# Altium project ChaoticCircuits.PrjPcb
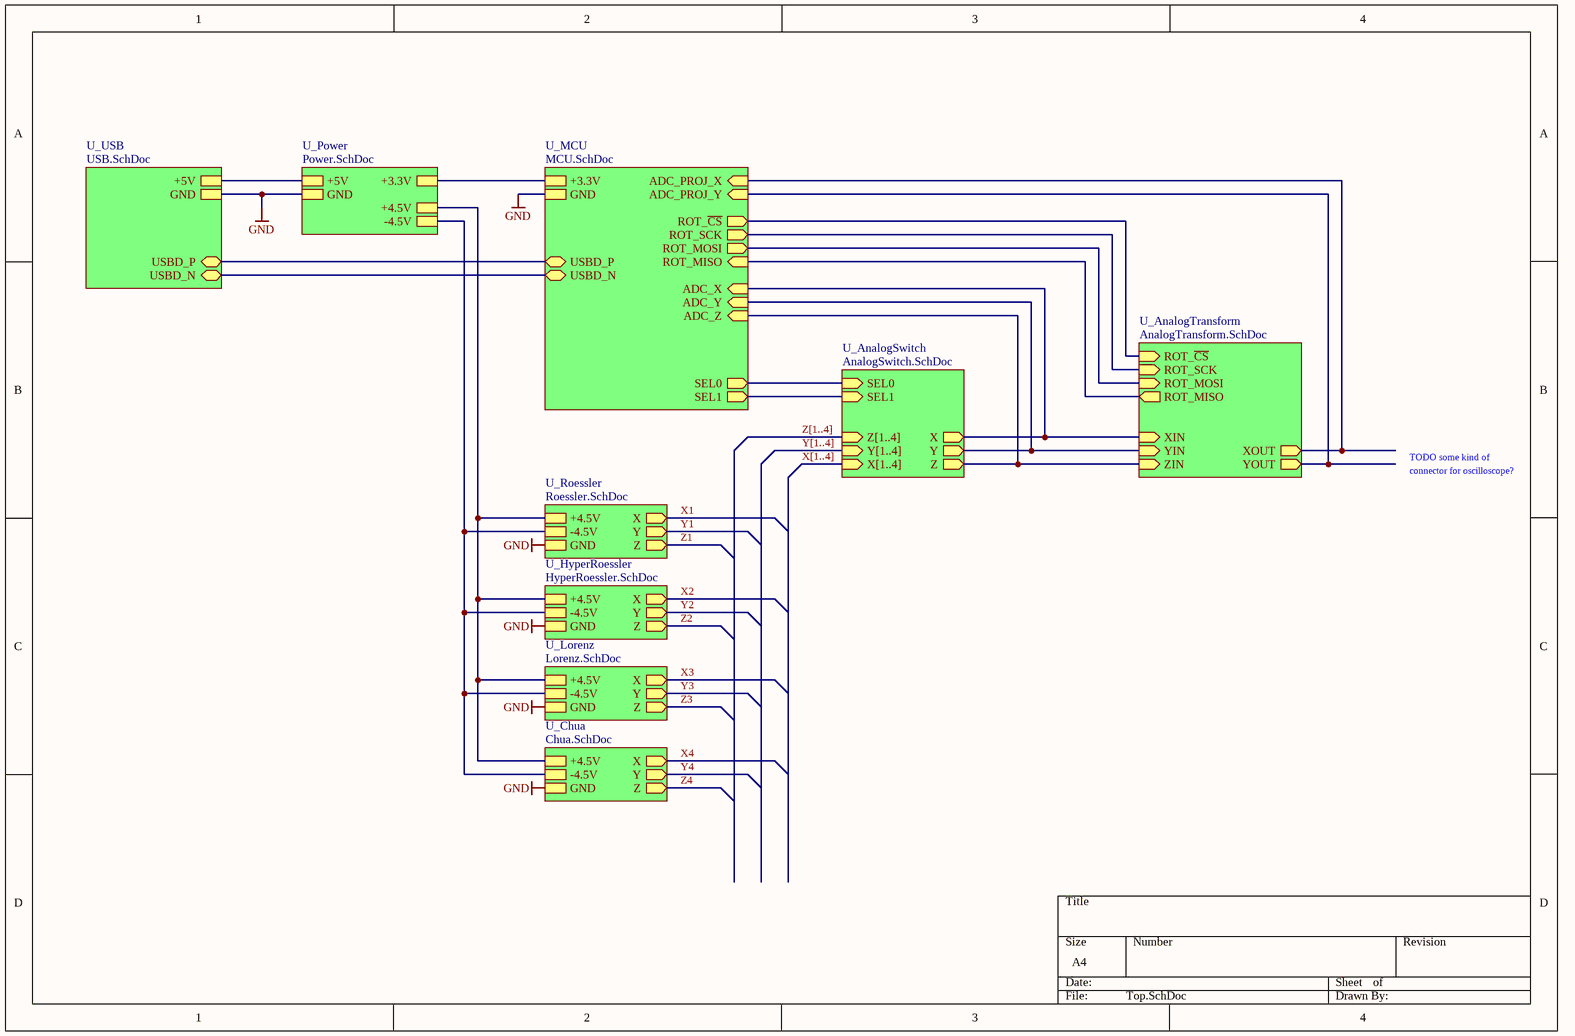
[diagram p0: Top.SchDoc]
Author: TheComet; BoardRevision: A0; ProjectTitle: Chaotic Circuits
10 sheets, 76 parts. Net scope: hierarchical (ports join the sheet entries above them; power ports are global).
Board file: ChaoticCircuits.PcbDoc
Sheets:
  Top.SchDoc
    U_Chua = Chua.SchDoc
    U_Power = Power.SchDoc
    U_AnalogSwitch = AnalogSwitch.SchDoc
    U_Roessler = Roessler.SchDoc
    U_MCU = MCU.SchDoc
    U_USB = USB.SchDoc
    U_HyperRoessler = HyperRoessler.SchDoc
    U_AnalogTransform = AnalogTransform.SchDoc
    U_Lorenz = Lorenz.SchDoc

## Sheet Top.SchDoc
size A4; Organization: Technokrat; Address1: 3 Minna Close; Address2: Belrose; Address3: NSW 2085; Address4: Australia; SheetNumber: 1; SheetTotal: 10

### Sub-sheets
U_AnalogSwitch = AnalogSwitch.SchDoc: SEL0 (in), SEL1 (in), X (out), Y (out), Z (out), X[1..4] (in), Y[1..4] (in), Z[1..4] (in)
U_AnalogTransform = AnalogTransform.SchDoc: XIN (in), YIN (in), ZIN (in), XOUT (out), YOUT (out), ROT_MISO (out), ROT_MOSI (in), ROT_SCK (in), ROT_~{CS} (in)
U_Chua = Chua.SchDoc: X (out), Y (out), Z (out), +4.5V, -4.5V, GND
U_HyperRoessler = HyperRoessler.SchDoc: X (out), Y (out), Z (out), GND, -4.5V, +4.5V
U_Lorenz = Lorenz.SchDoc: X (out), Y (out), Z (out), GND, -4.5V, +4.5V
U_MCU = MCU.SchDoc: +3.3V, GND, SEL0 (out), SEL1 (out), ADC_PROJ_Y (in), ADC_PROJ_X (in), USBD_P (bidir), USBD_N (bidir), ADC_X (in), ADC_Y (in), ADC_Z (in), ROT_~{CS} (out), ROT_SCK (out), ROT_MOSI (out), ROT_MISO (in)
U_Power = Power.SchDoc: GND, +5V, +3.3V, +4.5V, -4.5V
U_Roessler = Roessler.SchDoc: X (out), Y (out), Z (out), +4.5V, -4.5V, GND
U_USB = USB.SchDoc: GND, +5V, USBD_N (bidir), USBD_P (bidir)

### Nets
+3.3V: sheet U_Power/+3.3V, sheet U_MCU/+3.3V
+4.5V: sheet U_Chua/+4.5V, sheet U_Power/+4.5V, sheet U_Roessler/+4.5V, sheet U_HyperRoessler/+4.5V, sheet U_Lorenz/+4.5V
+5V: sheet U_Power/+5V, sheet U_USB/+5V
-4.5V: sheet U_Chua/-4.5V, sheet U_Power/-4.5V, sheet U_Roessler/-4.5V, sheet U_HyperRoessler/-4.5V, sheet U_Lorenz/-4.5V
GND: sheet U_Chua/GND, sheet U_Power/GND, sheet U_Roessler/GND, sheet U_MCU/GND, sheet U_USB/GND, sheet U_HyperRoessler/GND, sheet U_Lorenz/GND
USBD_N: sheet U_MCU/USBD_N, sheet U_USB/USBD_N
USBD_P: sheet U_MCU/USBD_P, sheet U_USB/USBD_P
X1: sheet U_Roessler/X
X2: sheet U_HyperRoessler/X
X3: sheet U_Lorenz/X
x': sheet U_MCU/ADC_PROJ_X, sheet U_AnalogTransform/XOUT
Y1: sheet U_Roessler/Y
Y2: sheet U_HyperRoessler/Y
Y3: sheet U_Lorenz/Y
y': sheet U_MCU/ADC_PROJ_Y, sheet U_AnalogTransform/YOUT
Z1: sheet U_Roessler/Z
Z2: sheet U_HyperRoessler/Z
Z3: sheet U_Lorenz/Z
NetU4_6: sheet U_AnalogSwitch/X, sheet U_MCU/ADC_X, sheet U_AnalogTransform/XIN
NetU4_7: sheet U_AnalogSwitch/Y, sheet U_MCU/ADC_Y, sheet U_AnalogTransform/YIN
NetU7_5: sheet U_AnalogSwitch/Z, sheet U_MCU/ADC_Z, sheet U_AnalogTransform/ZIN
NetU7_11: sheet U_MCU/ROT_MOSI, sheet U_AnalogTransform/ROT_MOSI
NetU7_12: sheet U_MCU/ROT_SCK, sheet U_AnalogTransform/ROT_SCK
NetU7_13: sheet U_MCU/ROT_~{CS}, sheet U_AnalogTransform/ROT_~{CS}
NetU9_16: sheet U_MCU/ROT_MISO, sheet U_AnalogTransform/ROT_MISO
(unnamed): sheet U_AnalogSwitch/SEL0, sheet U_MCU/SEL0
(unnamed): sheet U_AnalogSwitch/SEL1, sheet U_MCU/SEL1

### Buses and harness runs
bus X[1..4] = sheet U_AnalogSwitch/X[1..4]
bus Y[1..4] = sheet U_AnalogSwitch/Y[1..4]
bus Z[1..4] = sheet U_AnalogSwitch/Z[1..4]

### Notes on the sheet
- TODO some kind of
- connector for oscilloscope?
- Rev:
- /
- File:

## Sheet Chua.SchDoc
size A4; SheetNumber: 2; SheetTotal: 9
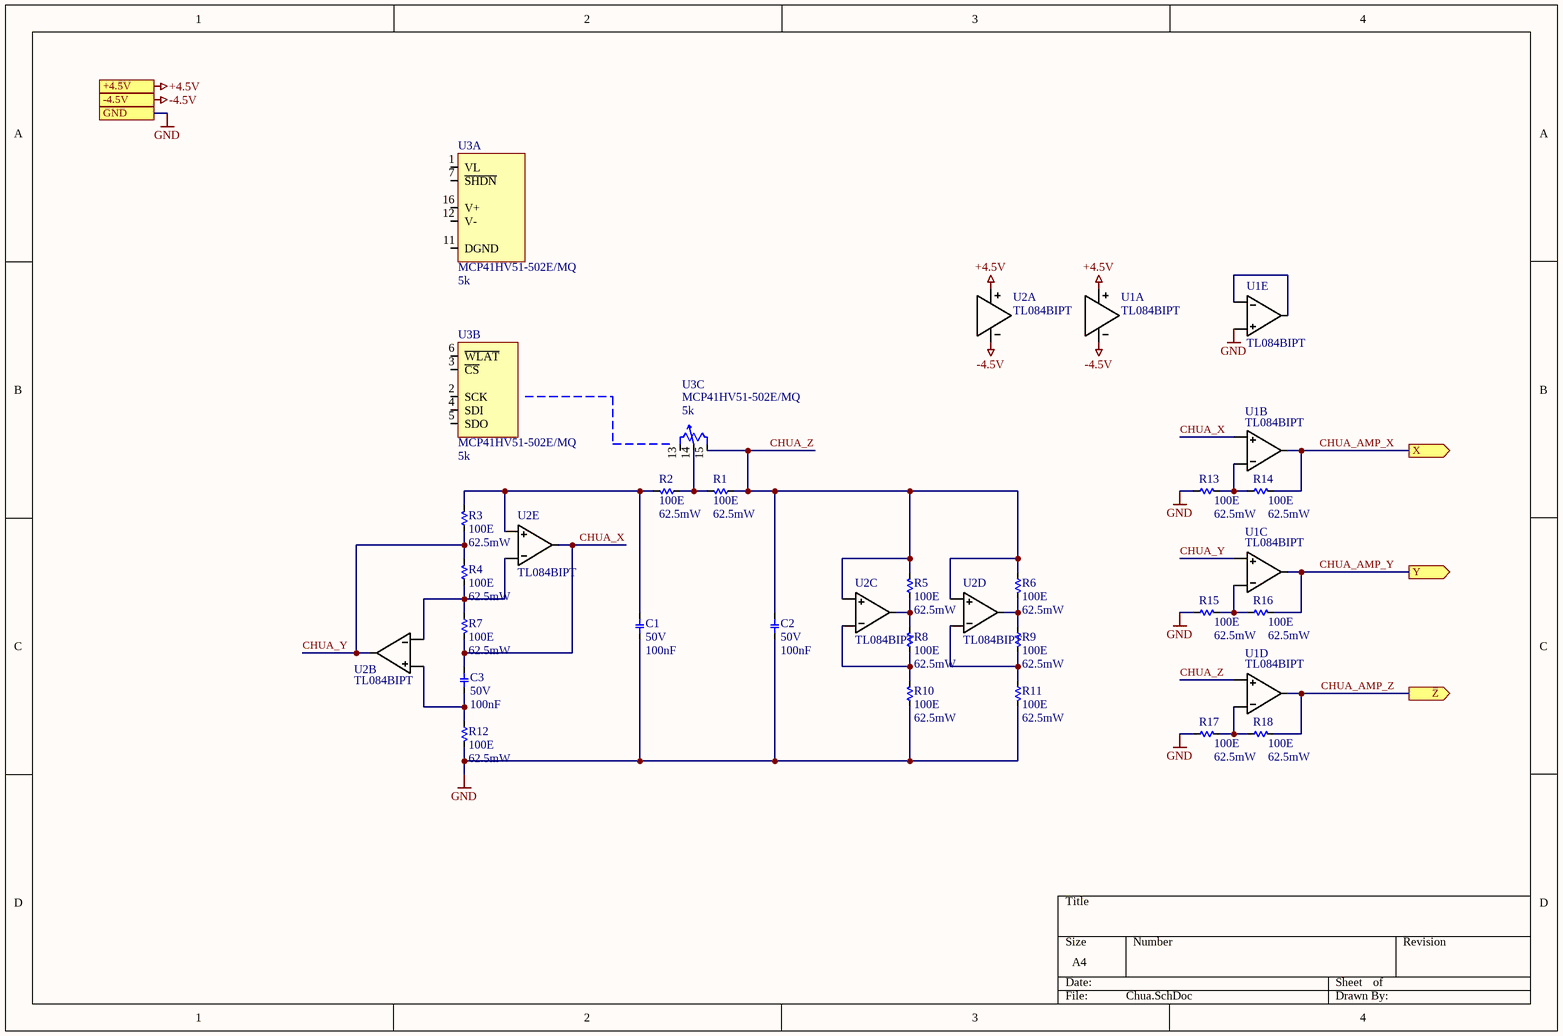
[diagram p1: Chua.SchDoc]

### Parts
C1  value 100nF  Value2: 50V  [CX7R0402C]  (hidden comment: 04025C104JAT2A)
C2  value 100nF  Value2: 50V  [CX7R0402C]  (hidden comment: 04025C104JAT2A)
C3  value 100nF  Value2: 50V  [CX7R0402C]  (hidden comment: 04025C104JAT2A)
R1  value 100E  Value2: 62.5mW  [RC0402]  (hidden comment: 0402FR-07100RL)
R2  value 100E  Value2: 62.5mW  [RC0402]  (hidden comment: 0402FR-07100RL)
R3  value 100E  Value2: 62.5mW  [RC0402]  (hidden comment: 0402FR-07100RL)
R4  value 100E  Value2: 62.5mW  [RC0402]  (hidden comment: 0402FR-07100RL)
R5  value 100E  Value2: 62.5mW  [RC0402]  (hidden comment: 0402FR-07100RL)
R6  value 100E  Value2: 62.5mW  [RC0402]  (hidden comment: 0402FR-07100RL)
R7  value 100E  Value2: 62.5mW  [RC0402]  (hidden comment: 0402FR-07100RL)
R8  value 100E  Value2: 62.5mW  [RC0402]  (hidden comment: 0402FR-07100RL)
R9  value 100E  Value2: 62.5mW  [RC0402]  (hidden comment: 0402FR-07100RL)
R10  value 100E  Value2: 62.5mW  [RC0402]  (hidden comment: 0402FR-07100RL)
R11  value 100E  Value2: 62.5mW  [RC0402]  (hidden comment: 0402FR-07100RL)
R12  value 100E  Value2: 62.5mW  [RC0402]  (hidden comment: 0402FR-07100RL)
R13  value 100E  Value2: 62.5mW  [RC0402]  (hidden comment: 0402FR-07100RL)
R14  value 100E  Value2: 62.5mW  [RC0402]  (hidden comment: 0402FR-07100RL)
R15  value 100E  Value2: 62.5mW  [RC0402]  (hidden comment: 0402FR-07100RL)
R16  value 100E  Value2: 62.5mW  [RC0402]  (hidden comment: 0402FR-07100RL)
R17  value 100E  Value2: 62.5mW  [RC0402]  (hidden comment: 0402FR-07100RL)
R18  value 100E  Value2: 62.5mW  [RC0402]  (hidden comment: 0402FR-07100RL)
U1  TL084BIPT  [TSSOP14_0.65_C]  (parts A,B,C,D,E of 5)
U2  TL084BIPT  [TSSOP14_0.65_C]  (parts A,B,C,D,E of 5)
U3  MCP41HV51-502E/MQ  value 5k  [QFN20_0.65_C]  (parts A,B,C of 3)

### Ports
+4.5V, -4.5V, GND, X (out), Y (out), Z (out)

### Nets
+4.5V: U1.4(VCC+) U2.4(VCC+) ; port +4.5V
-4.5V: U1.11(VCC-) U2.11(VCC-) ; port -4.5V
GND: C1.1 C2.1 R10.1 R11.1 R12.1 R13.2 R15.2 R17.2 U1.12(IN4+) ; port GND
CHUA_AMP_X: R14.1 U1.1(OUT1) ; port X
CHUA_AMP_Y: R16.1 U1.7(OUT2) ; port Y
CHUA_AMP_Z: R18.1 U1.8(OUT3) ; port Z
CHUA_X: C3.2 R7.1 U1.3(IN1+) U2.14(OUT4)
CHUA_Y: R3.2 R4.1 U1.5(IN2+) U2.1(OUT1)
CHUA_Z: C2.2 R1.1 R5.2 R6.2 U1.10(IN3+) U2.5(IN2+) U2.10(IN3+) U3.15(P0A)
NetC1_2: C1.2 R2.2 R3.1 U2.12(IN4+)
NetC3_1: C3.1 R12.2 U2.3(IN1+)
NetR1_2: R1.2 R2.1 U3.14(P0W)
NetR4_2: R4.2 R7.2 U2.2(IN1-) U2.13(IN4-)
NetR5_1: R5.1 R8.2 U2.7(OUT2)
NetR6_1: R6.1 R9.2 U2.8(OUT3)
NetR8_1: R8.1 R10.2 U2.6(IN2-)
NetR9_1: R9.1 R11.2 U2.9(IN3-)
NetR13_1: R13.1 R14.2 U1.2(IN1-)
NetR15_1: R15.1 R16.2 U1.6(IN2-)
NetR17_1: R17.1 R18.2 U1.9(IN3-)
NetU1_13: U1.13(IN4-) U1.14(OUT4)

Not connected (* = marked no-connect by the designer): U3 1(VL) 2(SCK) 3(~{CS}) 4(SDI) 5(SDO) 6(~{WLAT}) 7(~{SHDN}) 11(DGND) 12(V-) 13(P0B) 16(V+)

### Library data of the parts
C1-C3 = kyocera-C-X7R-0402: SMD Capacitor; CapacitanceCode: 104; VoltageCode: 5; Dielectric: C; ToleranceCode: J; MaxThicknessCode: E; Size: 0402
R1-R18 = YAGEO-RC-0402: SMD Resistor; TapingReelAndPower: 07; DefaultCode: L; ToleranceCode: F; ResistanceCode: 100R; PackagingTypeCode: R; Size: 0402; TemperatureCoefficientCode: -
U1 U2 = TL084: J-FET Amplifier 4 Circuit - 14-TSSOP; Type: TL084BIPT
U3 = MCP41HV51-502E/MQ: Digital Potentiometer 5k Ohm 1 Circuit 256 Taps SPI Interface 20-VQFN (5x5); Type: MCP41HV51-502E/MQ; Supplier 1: Digi-Key; Supplier Part Number 1: MCP41HV51-502E/MQ-ND

## Sheet Power.SchDoc
size A4; Organization: Technokrat; Address1: 3 Minna Close; Address2: Belrose; Address3: NSW 2085; Address4: Australia; SheetNumber: 3; SheetTotal: 3
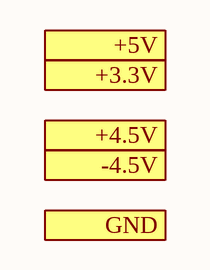
[diagram p2: Power.SchDoc]

### Ports
+3.3V, +4.5V, +5V, -4.5V, GND

### Notes on the sheet
- Rev:
- /
- File:

## Sheet AnalogSwitch.SchDoc
size A4; Organization: Technokrat; Address1: 3 Minna Close; Address2: Belrose; Address3: NSW 2085; Address4: Australia; SheetNumber: 5; SheetTotal: 10
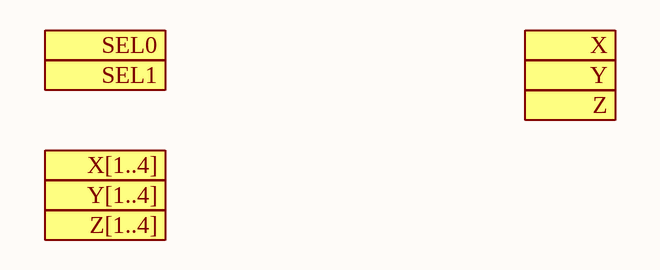
[diagram p3: AnalogSwitch.SchDoc]

### Ports
SEL0 (in), SEL1 (in), X (out), X[1..4] (in), Y (out), Y[1..4] (in), Z (out), Z[1..4] (in)

### Notes on the sheet
- Rev:
- /
- File:

## Sheet Roessler.SchDoc
size A4; Organization: Technokrat; Address1: 3 Minna Close; Address2: Belrose; Address3: NSW 2085; Address4: Australia; SheetNumber: 6; SheetTotal: 10
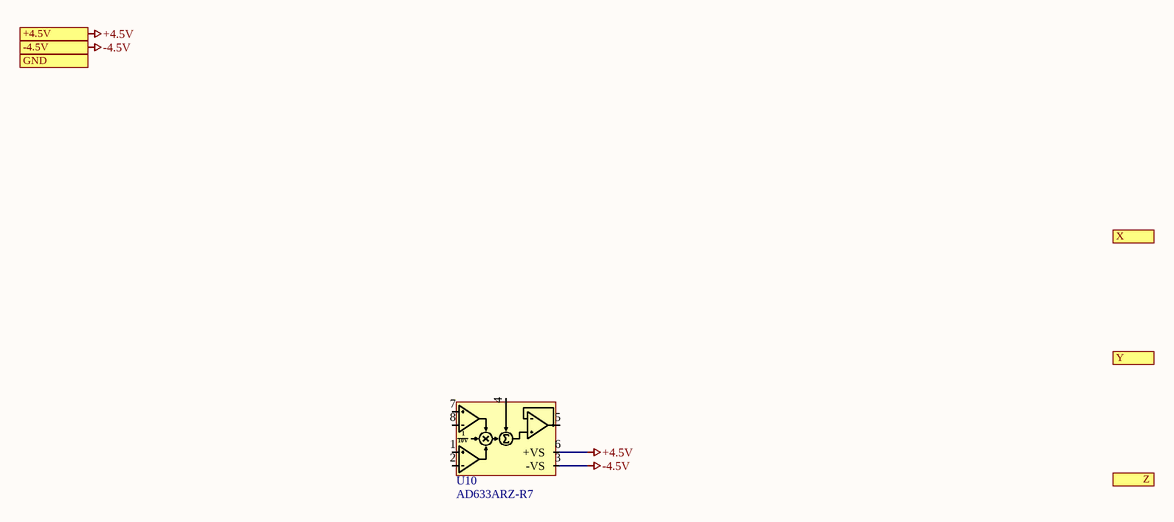
[diagram p4: Roessler.SchDoc]

### Parts
U10  AD633ARZ-R7  [SO8_1.27_C]

### Ports
+4.5V, -4.5V, GND, X (out), Y (out), Z (out)

### Nets
+4.5V: U10.6(+VS) ; port +4.5V
-4.5V: U10.3(-VS) ; port -4.5V

Not connected (* = marked no-connect by the designer): U10 1(Y1) 2(Y2) 4(Z) 5(W) 7(X1) 8(X2)

### Notes on the sheet
- Rev:
- /
- File:
- (in symbol AD633AR-R7) 10V

### Library data of the parts
U10 = AD633AR-R7: Analog Multiplier 4-Quadrant 8-SOIC; Type: AD633ARZ-R7; Supplier 1: Arrow Electronics; Supplier Part Number 1: AD633ARZ-R7

## Sheet MCU.SchDoc
size A4; Organization: Technokrat; Address1: 3 Minna Close; Address2: Belrose; Address3: NSW 2085; Address4: Australia; SheetNumber: 7; SheetTotal: 10
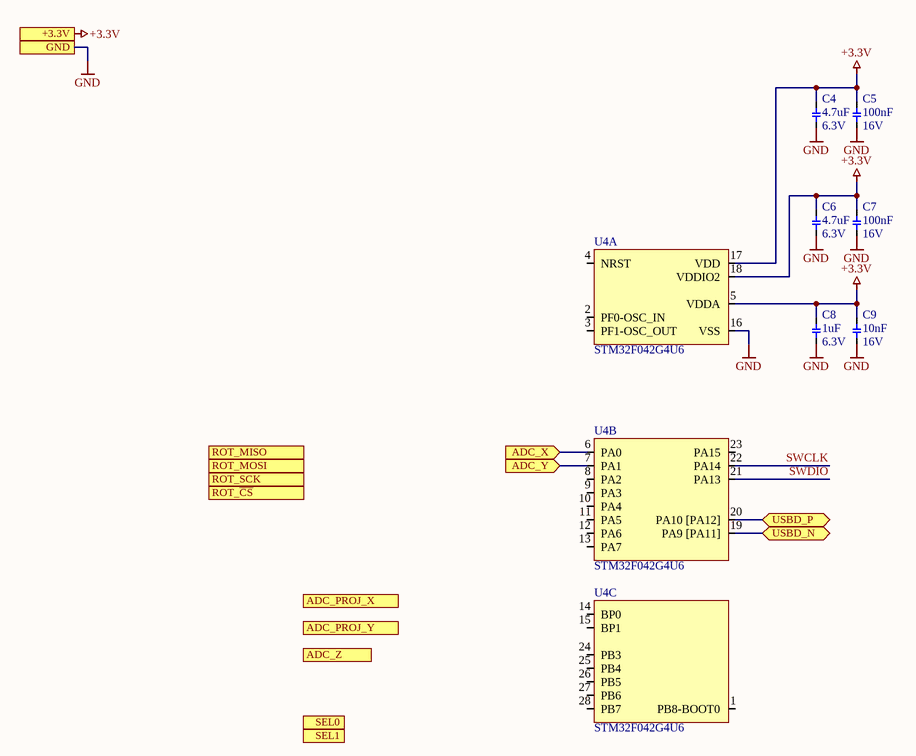
[diagram p5: MCU.SchDoc]

### Parts
C4  value 4.7uF  Value2: 6.3V  [CX7R0603K]  (hidden comment: 06036C475JAT2A)
C5  value 100nF  Value2: 16V  [CX7R0402C]  (hidden comment: 0402YC104JAT2A)
C6  value 4.7uF  Value2: 6.3V  [CX7R0603K]  (hidden comment: 06036C475JAT2A)
C7  value 100nF  Value2: 16V  [CX7R0402C]  (hidden comment: 0402YC104JAT2A)
C8  value 1uF  Value2: 6.3V  [CX7R0603K]  (hidden comment: 06036C105JAT2A)
C9  value 10nF  Value2: 16V  [CX7R0402C]  (hidden comment: 0402YC103JAT2A)
U4  STM32F042G4U6  [UFQFPN28_0.5_C]  (parts A,B,C of 3)

### Ports
+3.3V, ADC_PROJ_X (in), ADC_PROJ_Y (in), ADC_X (in), ADC_Y (in), ADC_Z (in), GND, ROT_MISO (in), ROT_MOSI (out), ROT_SCK (out), ROT_~{CS} (out), SEL0 (out), SEL1 (out), USBD_N (bidir), USBD_P (bidir)

### Nets
+3.3V: C4.2 C5.2 C6.2 C7.2 C8.2 C9.2 U4.5(VDDA) U4.17(VDD) U4.18(VDDIO2) ; port +3.3V
GND: C4.1 C5.1 C6.1 C7.1 C8.1 C9.1 U4.16(VSS) ; port GND
SWCLK: U4.22(PA14)
SWDIO: U4.21(PA13)
USBD_N: U4.19(PA9_[PA11]) ; port USBD_N
USBD_P: U4.20(PA10_[PA12]) ; port USBD_P
NetU4_6: U4.6(PA0) ; port ADC_X
NetU4_7: U4.7(PA1) ; port ADC_Y

Not connected (* = marked no-connect by the designer): U4 1(PB8-BOOT0) 2(PF0-OSC_IN) 3(PF1-OSC_OUT) 4(NRST) 8(PA2) 9(PA3) 10(PA4) 11(PA5) 12(PA6) 13(PA7) 14(BP0) 15(BP1) 23(PA15) 24(PB3) 25(PB4) 26(PB5) 27(PB6) 28(PB7)

### Notes on the sheet
- Rev:
- /
- File:

### Library data of the parts
C4 C6 = kyocera-C-X7R-0603: SMD Capacitor; Dielectric: C; ToleranceCode: J; MaxThicknessCode: K; VoltageCode: 6; CapacitanceCode: 475; Size: 0603
C5 C7 = kyocera-C-X7R-0402: SMD Capacitor; CapacitanceCode: 104; VoltageCode: Y; Dielectric: C; ToleranceCode: J; MaxThicknessCode: E; Size: 0402
C8 = kyocera-C-X7R-0603: SMD Capacitor; Dielectric: C; ToleranceCode: J; MaxThicknessCode: K; VoltageCode: 6; CapacitanceCode: 105; Size: 0603
C9 = kyocera-C-X7R-0402: SMD Capacitor; CapacitanceCode: 103; VoltageCode: Y; Dielectric: C; ToleranceCode: J; MaxThicknessCode: E; Size: 0402
U4 = STM32F042G4U6: ARM® Cortex®-M0 series Microcontroller IC 32-Bit 48MHz 16KB (16K x 8) FLASH 28-UFQFPN (4x4); Type: STM32F042G4U6; Supplier 1: Digi-Key; Supplier Part Number 1: 497-17830-ND

## Sheet USB.SchDoc
size A4; SheetNumber: 8; SheetTotal: 10
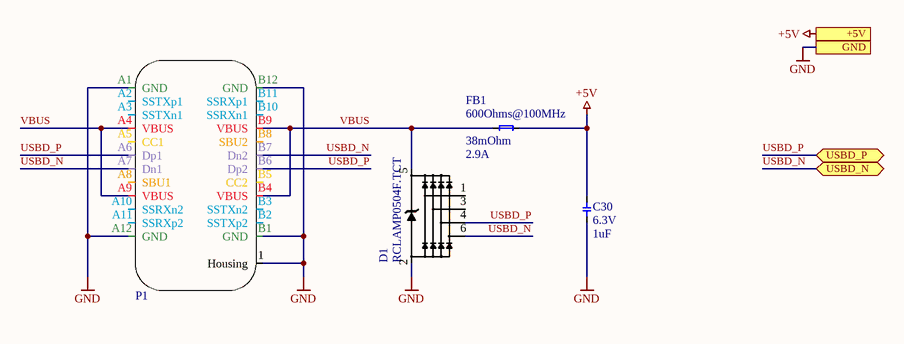
[diagram p6: USB.SchDoc]

### Parts
C30  value 1uF  Value2: 6.3V  [CX7R0603K]  (hidden comment: 06036C105JAT2A)
D1  RCLAMP0504F.TCT  [SOT23-6L_0.65_C]
FB1  DCR: 38mOhm  Current: 2.9A  Impedance: 600Ohms@100MHz  [BLM31KN_SN_1206_C]  (hidden comment: BLM31KN601SN1L)
P1  10132328-10011LF  [USB_TYPEC_VERTICAL_10132328-10011LF]  (value not drawn)

### Ports
+5V, GND, USBD_N (bidir), USBD_P (bidir)

### Nets
+5V: C30.2 FB1.2 ; port +5V
GND: C30.1 D1.2 P1.1(Housing) P1.A1(GND) P1.A12(GND) P1.B1(GND) P1.B12(GND) ; port GND
USBD_N: D1.6 P1.A7(Dn1) P1.B7(Dn2) ; port USBD_N
USBD_P: D1.4 P1.A6(Dp1) P1.B6(Dp2) ; port USBD_P
VBUS: D1.5 FB1.1 P1.A4(VBUS) P1.A9(VBUS) P1.B4(VBUS) P1.B9(VBUS)

Not connected (* = marked no-connect by the designer): D1 1 3; P1 A2(SSTXp1) A3(SSTXn1) A5(CC1) A8(SBU1) A10(SSRXn2) A11(SSRXp2) B2(SSTXp2) B3(SSTXn2) B5(CC2) B8(SBU2) B10(SSRXn1) B11(SSRXp1)

### Library data of the parts
C30 = kyocera-C-X7R-0603: as C8 on sheet MCU; Size: 0603
D1 = RCLAMP0504F.TCT: 23V Clamp 6A (8/20µs) Ipp Tvs Diode Surface Mount SC-70-6; Type: RCLAMP0504F.TCT; Supplier 1: Digi-Key; Supplier Part Number 1: RCLAMP0504FCT-ND
FB1 = BLM31KN601SN1L: 600 Ohms @ 100 MHz 1 Power Line Ferrite Bead 1206 (3216 Metric) 2.9A 38mOhm; Type: BLM31KN601SN1L
P1 = 10132328-10011LF: USB-C (USB TYPE-C) USB 3.2 Gen 2 (USB 3.1 Gen 2, Superspeed + (USB 3.1)) Receptacle Connector 24 Position Surface Mount, Through Hole; Supplier 1: Digi-Key; Type: 10132328-10011LF; Supplier Part Number 1: 609-5380-1-ND

## Sheet HyperRoessler.SchDoc
size A4; SheetNumber: 9; SheetTotal: 10
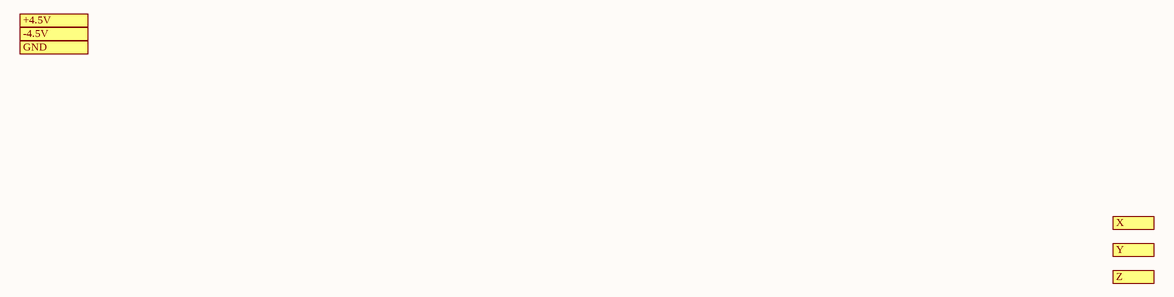
[diagram p7: HyperRoessler.SchDoc]

### Ports
+4.5V, -4.5V, GND, X (out), Y (out), Z (out)

## Sheet AnalogTransform.SchDoc
size A4; Organization: Technokrat; Address1: 3 Minna Close; Address2: Belrose; Address3: NSW 2085; Address4: Australia; SheetNumber: 4; SheetTotal: 10
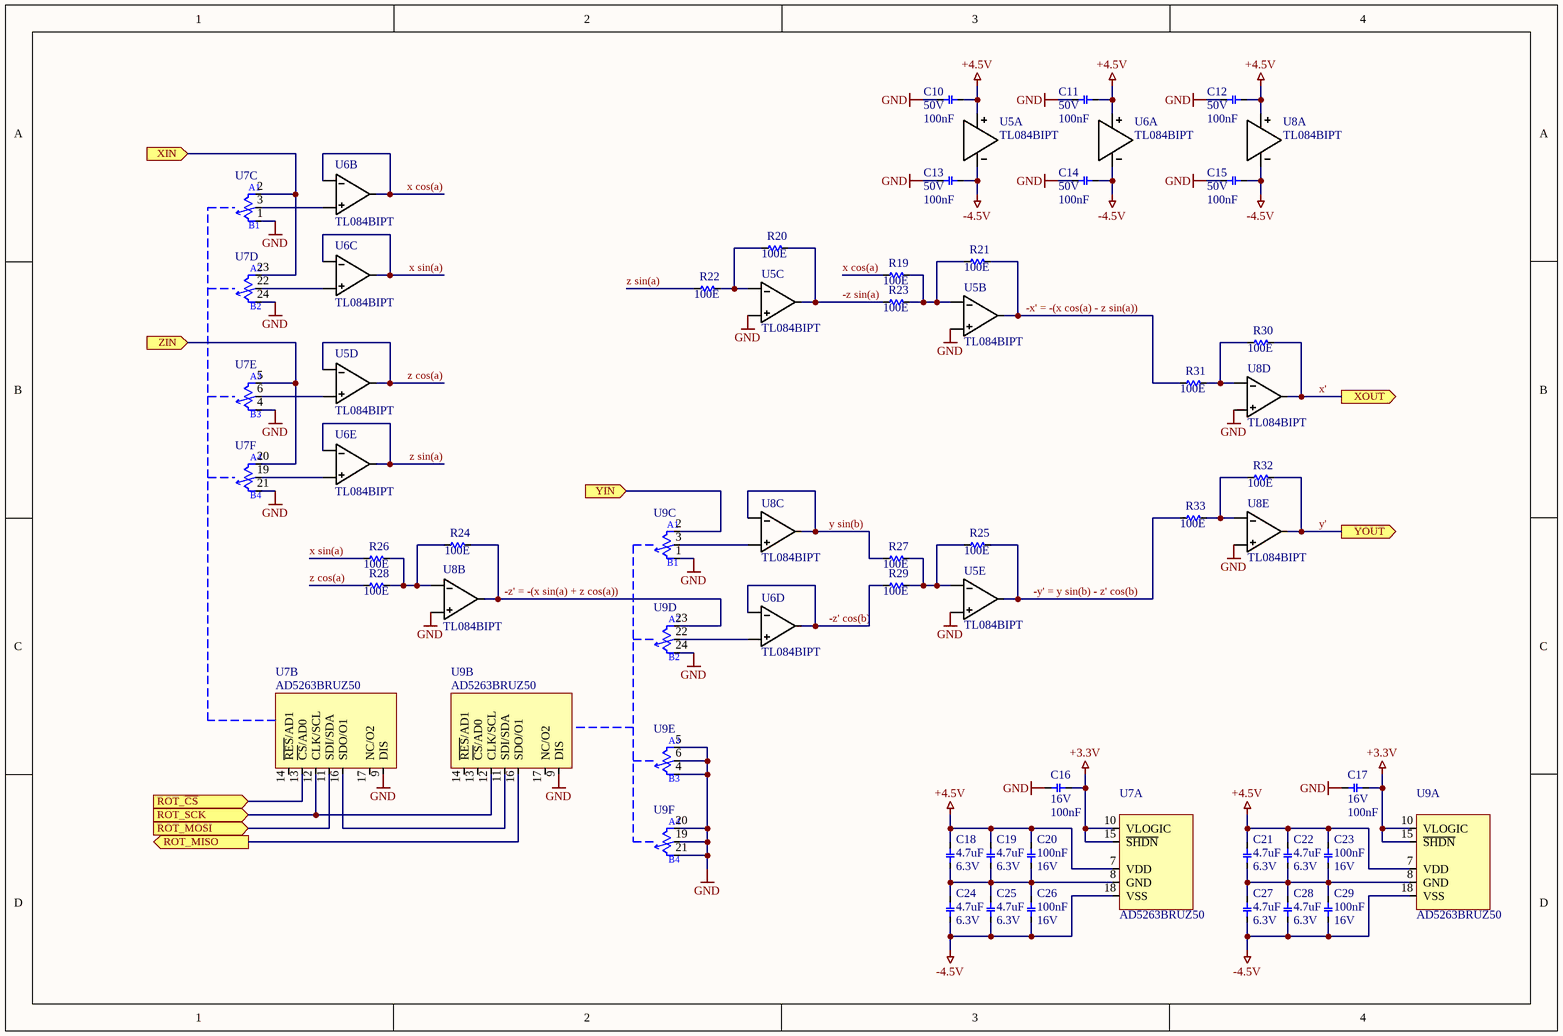
[diagram p8: AnalogTransform.SchDoc]

### Parts
C10  value 100nF  Value2: 50V  [CX7R0402C]  (hidden comment: 04025C104JAT2A)
C11  value 100nF  Value2: 50V  [CX7R0402C]  (hidden comment: 04025C104JAT2A)
C12  value 100nF  Value2: 50V  [CX7R0402C]  (hidden comment: 04025C104JAT2A)
C13  value 100nF  Value2: 50V  [CX7R0402C]  (hidden comment: 04025C104JAT2A)
C14  value 100nF  Value2: 50V  [CX7R0402C]  (hidden comment: 04025C104JAT2A)
C15  value 100nF  Value2: 50V  [CX7R0402C]  (hidden comment: 04025C104JAT2A)
C16  value 100nF  Value2: 16V  [CX7R0402C]  (hidden comment: 0402YC104JAT2A)
C17  value 100nF  Value2: 16V  [CX7R0402C]  (hidden comment: 0402YC104JAT2A)
C18  value 4.7uF  Value2: 6.3V  [CX7R0603K]  (hidden comment: 06036C475JAT2A)
C19  value 4.7uF  Value2: 6.3V  [CX7R0603K]  (hidden comment: 06036C475JAT2A)
C20  value 100nF  Value2: 16V  [CX7R0402C]  (hidden comment: 0402YC104JAT2A)
C21  value 4.7uF  Value2: 6.3V  [CX7R0603K]  (hidden comment: 06036C475JAT2A)
C22  value 4.7uF  Value2: 6.3V  [CX7R0603K]  (hidden comment: 06036C475JAT2A)
C23  value 100nF  Value2: 16V  [CX7R0402C]  (hidden comment: 0402YC104JAT2A)
C24  value 4.7uF  Value2: 6.3V  [CX7R0603K]  (hidden comment: 06036C475JAT2A)
C25  value 4.7uF  Value2: 6.3V  [CX7R0603K]  (hidden comment: 06036C475JAT2A)
C26  value 100nF  Value2: 16V  [CX7R0402C]  (hidden comment: 0402YC104JAT2A)
C27  value 4.7uF  Value2: 6.3V  [CX7R0603K]  (hidden comment: 06036C475JAT2A)
C28  value 4.7uF  Value2: 6.3V  [CX7R0603K]  (hidden comment: 06036C475JAT2A)
C29  value 100nF  Value2: 16V  [CX7R0402C]  (hidden comment: 0402YC104JAT2A)
R19  value 100E  [RC0402]  (hidden comment: 0402FR-07100RL)
R20  value 100E  [RC0402]  (hidden comment: 0402FR-07100RL)
R21  value 100E  [RC0402]  (hidden comment: 0402FR-07100RL)
R22  value 100E  [RC0402]  (hidden comment: 0402FR-07100RL)
R23  value 100E  [RC0402]  (hidden comment: 0402FR-07100RL)
R24  value 100E  [RC0402]  (hidden comment: 0402FR-07100RL)
R25  value 100E  [RC0402]  (hidden comment: 0402FR-07100RL)
R26  value 100E  [RC0402]  (hidden comment: 0402FR-07100RL)
R27  value 100E  [RC0402]  (hidden comment: 0402FR-07100RL)
R28  value 100E  [RC0402]  (hidden comment: 0402FR-07100RL)
R29  value 100E  [RC0402]  (hidden comment: 0402FR-07100RL)
R30  value 100E  [RC0402]  (hidden comment: 0402FR-07100RL)
R31  value 100E  [RC0402]  (hidden comment: 0402FR-07100RL)
R32  value 100E  [RC0402]  (hidden comment: 0402FR-07100RL)
R33  value 100E  [RC0402]  (hidden comment: 0402FR-07100RL)
U5  TL084BIPT  [TSSOP14_0.65_C]  (parts A,B,C,D,E of 5)
U6  TL084BIPT  [TSSOP14_0.65_C]  (parts A,B,C,D,E of 5)
U7  AD5263BRUZ50  [TSSOP24_0.65_C]  (parts A,B,C,D,E,F of 6)
U8  TL084BIPT  [TSSOP14_0.65_C]  (parts A,B,C,D,E of 5)
U9  AD5263BRUZ50  [TSSOP24_0.65_C]  (parts A,B,C,D,E,F of 6)

### Ports
ROT_MISO (out), ROT_MOSI (in), ROT_SCK (in), ROT_~{CS} (in), XIN (in), XOUT (out), YIN (in), YOUT (out), ZIN (in)

### Nets
+3.3V: C16.2 C17.2 U7.10(VLOGIC) U7.15(~{SHDN}) U9.10(VLOGIC) U9.15(~{SHDN})
+4.5V: C10.2 C11.2 C12.2 C18.2 C19.2 C20.2 C21.2 C22.2 C23.2 U5.4(VCC+) U6.4(VCC+) U7.7(VDD) U8.4(VCC+) U9.7(VDD)
-4.5V: C13.2 C14.2 C15.2 C24.1 C25.1 C26.1 C27.1 C28.1 C29.1 U5.11(VCC-) U6.11(VCC-) U7.18(VSS) U8.11(VCC-) U9.18(VSS)
GND: C10.1 C11.1 C12.1 C13.1 C14.1 C15.1 C16.1 C17.1 U5.3(IN1+) U5.5(IN2+) U5.12(IN4+) U7.1(B1) U7.4(B3) U7.9(DIS) U7.21(B4) U7.24(B2) U8.3(IN1+) U8.10(IN3+) U8.12(IN4+) U9.1(B1) U9.4(B3) U9.5(A3) U9.6(W3) U9.9(DIS) U9.19(W4) U9.20(A4) U9.21(B4) U9.24(B2)
-x' = -(x cos(a) - z sin(a)): R21.2 R31.1 U5.1(OUT1)
-y' = y sin(b) - z' cos(b): R25.2 R33.1 U5.14(OUT4)
-z sin(a): R20.2 R23.1 U5.7(OUT2)
-z' = -(x sin(a) + z cos(a)): R24.2 U8.1(OUT1) U9.23(A2)
-z' cos(b): R29.1 U6.8(OUT3) U6.9(IN3-)
x cos(a): R19.1 U6.1(OUT1) U6.2(IN1-)
x sin(a): R26.1 U6.6(IN2-) U6.7(OUT2)
x': R30.2 U8.8(OUT3) ; port XOUT
y sin(b): R27.1 U8.6(IN2-) U8.7(OUT2)
y': R32.2 U8.14(OUT4) ; port YOUT
z cos(a): R28.1 U5.8(OUT3) U5.9(IN3-)
z sin(a): R22.1 U6.13(IN4-) U6.14(OUT4)
NetC18_1: C18.1 C19.1 C20.1 C24.2 C25.2 C26.2 U7.8(GND)
NetC21_1: C21.1 C22.1 C23.1 C27.2 C28.2 C29.2 U9.8(GND)
NetR19_2: R19.2 R21.1 R23.2 U5.2(IN1-)
NetR20_1: R20.1 R22.2 U5.6(IN2-)
NetR24_1: R24.1 R26.2 R28.2 U8.2(IN1-)
NetR25_1: R25.1 R27.2 R29.2 U5.13(IN4-)
NetR30_1: R30.1 R31.2 U8.9(IN3-)
NetR32_1: R32.1 R33.2 U8.13(IN4-)
NetU4_6: U7.2(A1) U7.23(A2) ; port XIN
NetU4_7: U9.2(A1) ; port YIN
NetU5_10: U5.10(IN3+) U7.6(W3)
NetU6_3: U6.3(IN1+) U7.3(W1)
NetU6_5: U6.5(IN2+) U7.22(W2)
NetU6_10: U6.10(IN3+) U9.22(W2)
NetU6_12: U6.12(IN4+) U7.19(W4)
NetU7_5: U7.5(A3) U7.20(A4) ; port ZIN
NetU7_11: U7.11(SDI/SDA) ; port ROT_MOSI
NetU7_12: U7.12(CLK/SCL) U9.12(CLK/SCL) ; port ROT_SCK
NetU7_13: U7.13(~{CS}/AD0) ; port ROT_~{CS}
NetU7_16: U7.16(SDO/O1) U9.11(SDI/SDA)
NetU8_5: U8.5(IN2+) U9.3(W1)
NetU9_16: U9.16(SDO/O1) ; port ROT_MISO

Not connected (* = marked no-connect by the designer): U7 14(~{RES}/AD1) 17(NC/O2); U9 13(~{CS}/AD0) 14(~{RES}/AD1) 17(NC/O2)

### Notes on the sheet
- Rev:
- /
- File:

### Library data of the parts
C10-C15 = kyocera-C-X7R-0402: as C1 on sheet Chua; Size: 0402
C16 C17 C20 C23 C26 C29 = kyocera-C-X7R-0402: as C5 on sheet MCU; Size: 0402
C18 C19 C21 C22 C24 C25 C27 C28 = kyocera-C-X7R-0603: as C4 on sheet MCU; Size: 0603
R19-R33 = YAGEO-RC-0402: SMD Resistor; ToleranceCode: F; PackagingTypeCode: R; TapingReelAndPower: 07; DefaultCode: L; ResistanceCode: 100R; Value2: 62.5mW; Size: 0402; TemperatureCoefficientCode: -
U5 U6 U8 = TL084: J-FET Amplifier 4 Circuit - 14-TSSOP; Type: TL084BIPT
U7 U9 = AD5263BRUZ50: Digital Potentiometer 50k Ohm 4 Circuit 256 Taps I²C, SPI Interface 24-TSSOP; Type: AD5263BRUZ50; Supplier 1: Digi-Key; Supplier Part Number 1: 505-AD5263BRUZ50-ND

## Sheet Lorenz.SchDoc
size A4; SheetNumber: 10; SheetTotal: 10
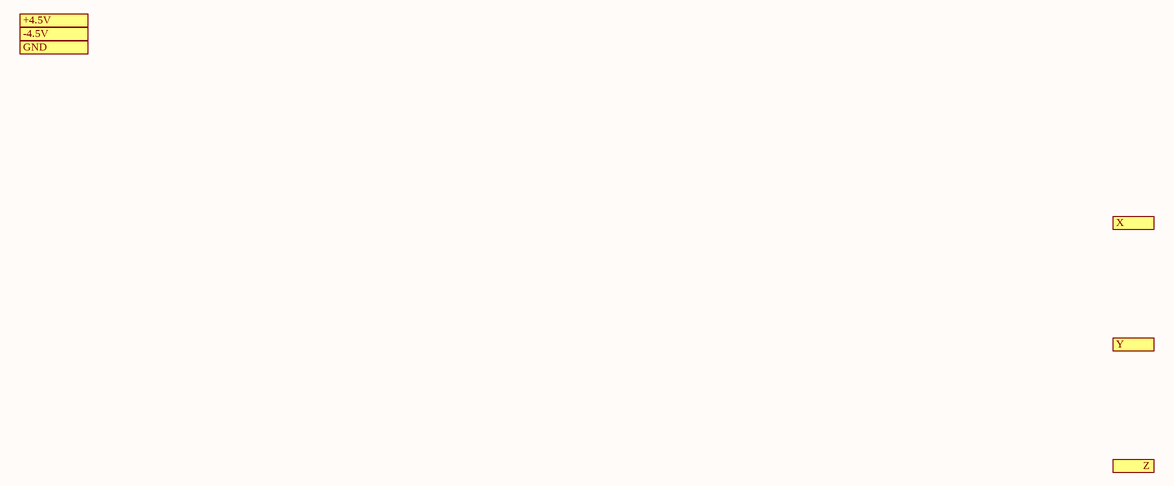
[diagram p9: Lorenz.SchDoc]

### Ports
+4.5V, -4.5V, GND, X (out), Y (out), Z (out)

## Nets that join several sheets
+3.3V: MCU (9 pins), AnalogTransform (6 pins)
+4.5V: Chua (U1.4 U2.4), Roessler (U10.6), AnalogTransform (14 pins)
-4.5V: Chua (U1.11 U2.11), Roessler (U10.3), AnalogTransform (14 pins)
GND: Chua (9 pins), MCU (7 pins), USB (7 pins), AnalogTransform (28 pins)
NetU4_6: MCU (U4.6), AnalogTransform (U7.2 U7.23)
NetU4_7: MCU (U4.7), AnalogTransform (U9.2)
USBD_N: MCU (U4.19), USB (D1.6 P1.A7 P1.B7)
USBD_P: MCU (U4.20), USB (D1.4 P1.A6 P1.B6)